# Altium schematic sheet V2_0.SchDoc: gemschematic_Chris_edits
size 409 x 289 mm; Date: 4/8/2022 10:16:15 AM; SheetNumber: 1; Origin: Eagle; GateName_1: G$1; SymbolName_1: A3L-LOC; LibraryName: frames; DeviceSetName: A3L-LOC; Sheet: Sheet:
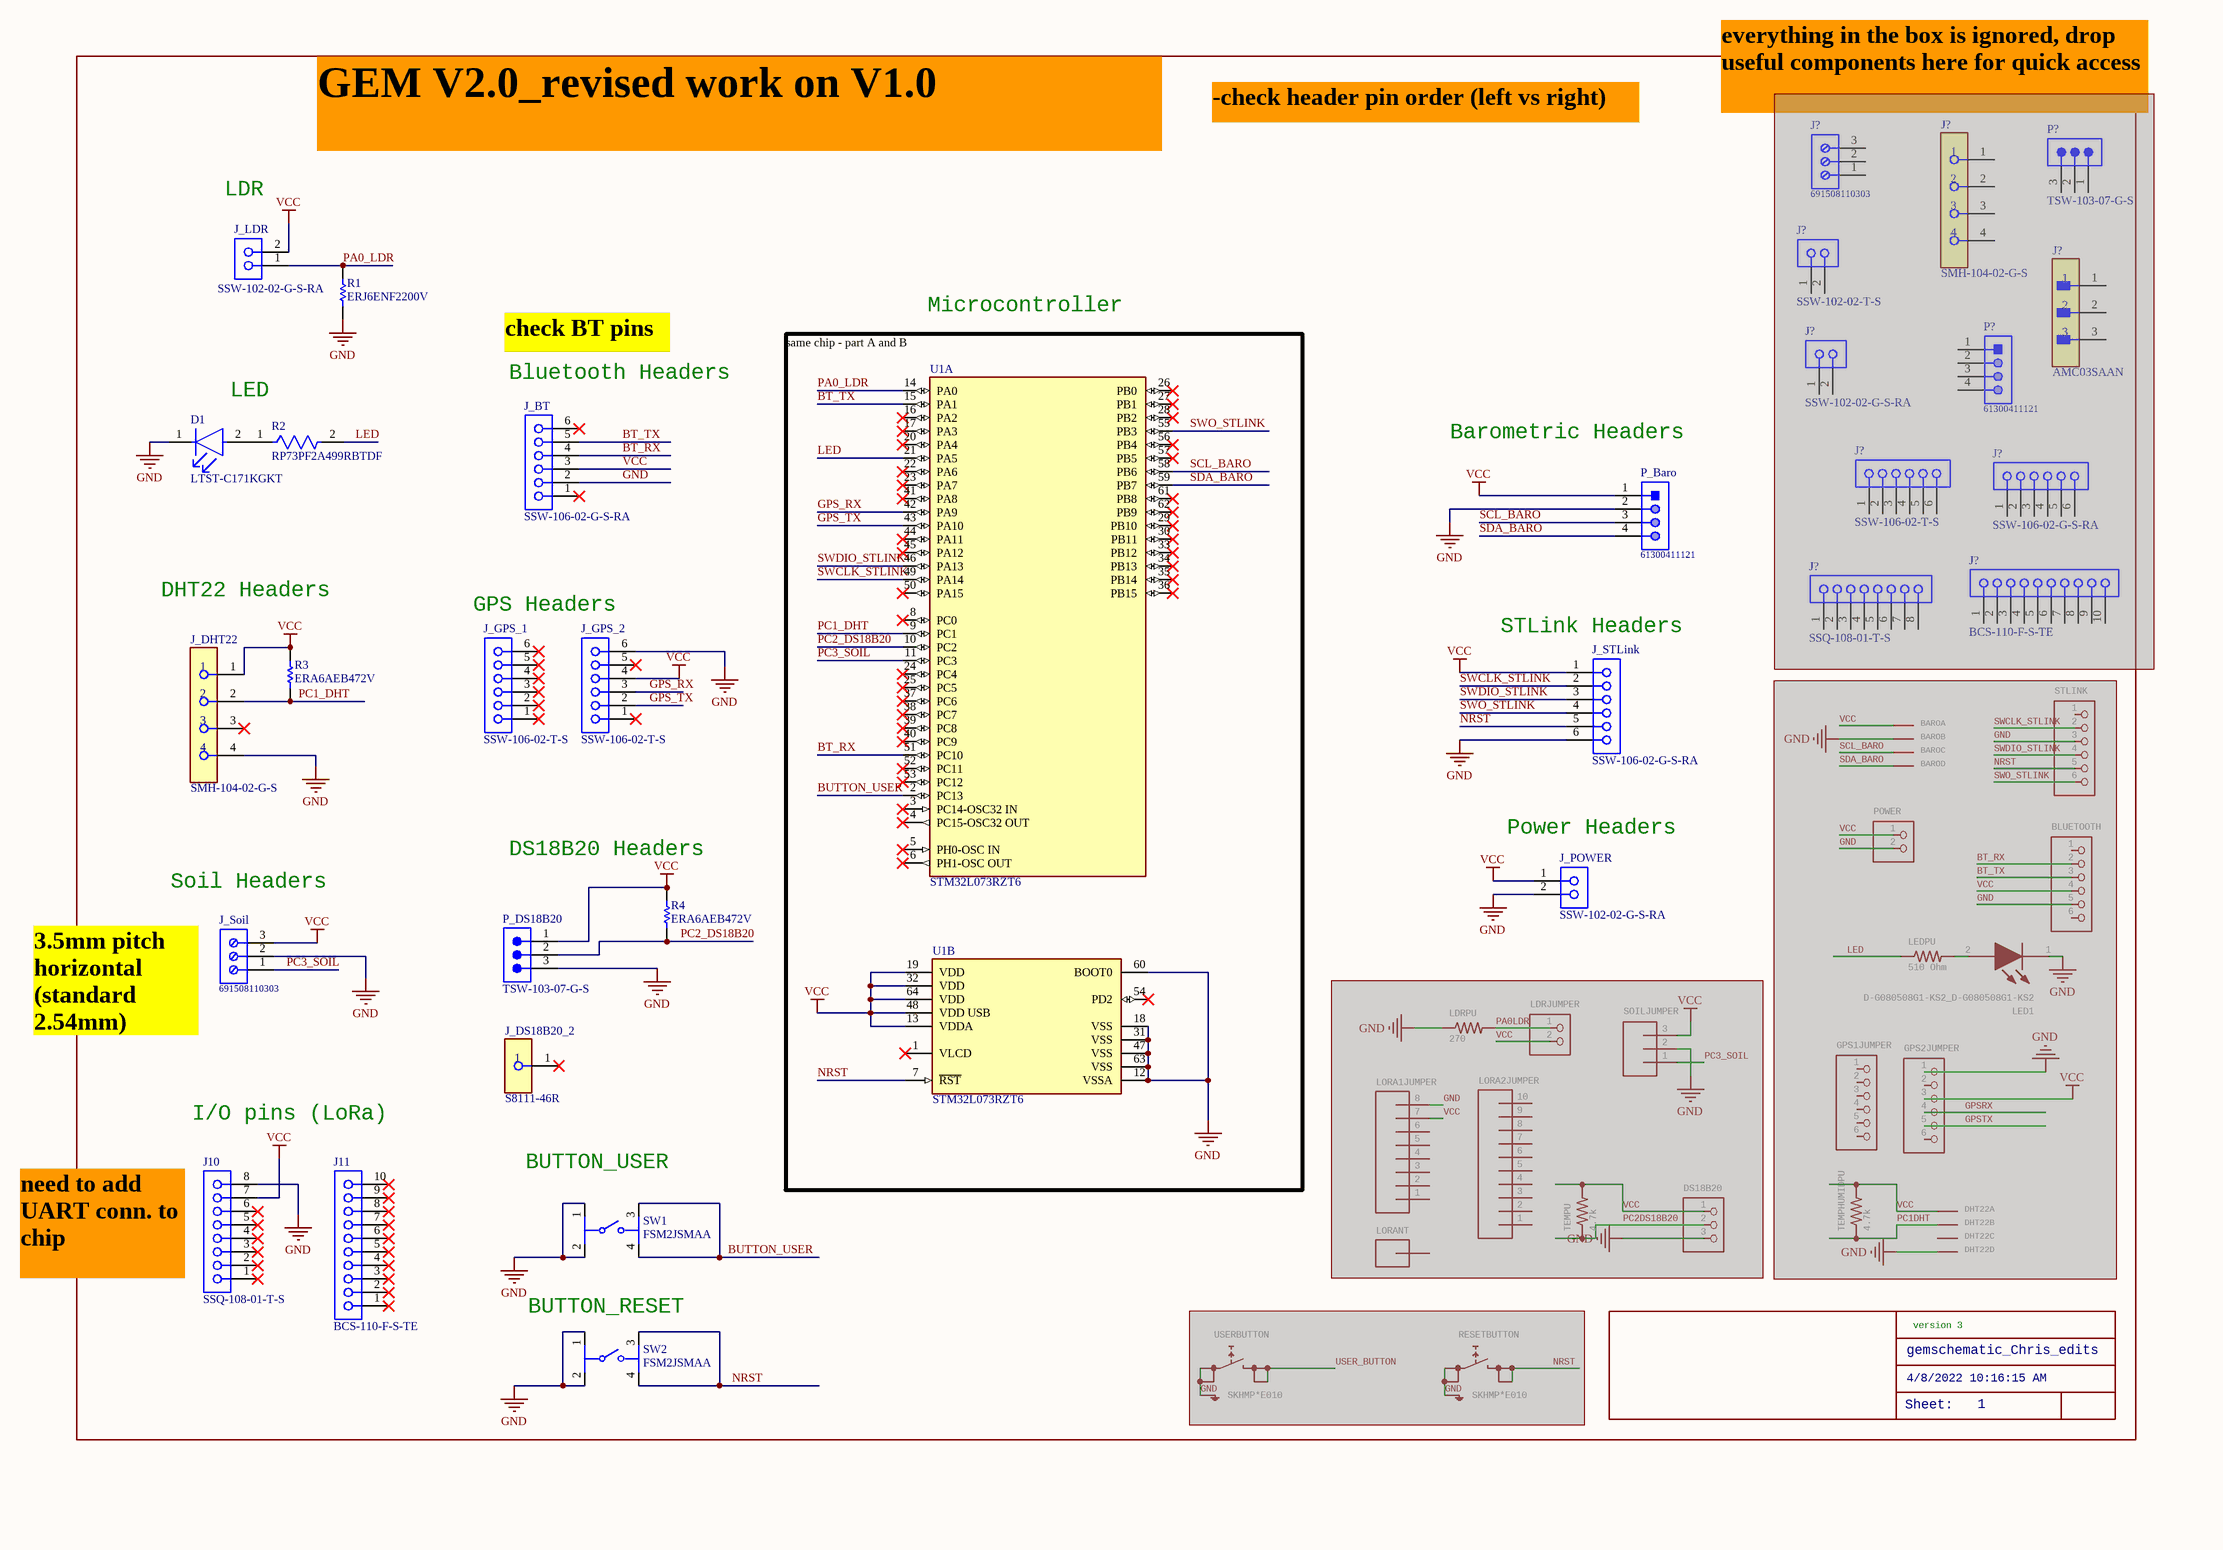
[diagram p0: V2_0.SchDoc]

## Parts
(Parts that share a designator on the sheet are numbered #1, #2 ... from top to bottom, then left to right.)
BARO  22-23-2041  [22-23-2041]  (value not drawn)  (parts A,B,C,D of 4)  (masked out: inside a compile mask, not in the netlist)
BLUETOOTH  PINHD-1X6  [1X06]  (value not drawn)  (masked out: inside a compile mask, not in the netlist)
D1  LTST-C171KGKT  [FP-LTST-C171KGKT-MFG]
DHT22  22-23-2041  [22-23-2041]  (value not drawn)  (parts A,B,C,D of 4)  (masked out: inside a compile mask, not in the netlist)
DS18B20  PINHD-1X3  [1X03]  (value not drawn)  (masked out: inside a compile mask, not in the netlist)
GPS1JUMPER  HEADER-1X670MIL  [1X06_ROUND_70]  (value not drawn)  (masked out: inside a compile mask, not in the netlist)
GPS2JUMPER  HEADER-1X670MIL  [1X06_ROUND_70]  (value not drawn)  (masked out: inside a compile mask, not in the netlist)
J10  SSQ-108-01-T-S  [SMTC-SSQ-108-01-X-S]
J11  BCS-110-F-S-TE  [SMTC-BCS-110-X-S-TE]
J?#1  SMH-104-02-G-S  [FP-SMH-104-02-G-S-MFG]  (masked out: inside a compile mask, not in the netlist)
J?#2  691508110303  [691508110303]  (masked out: inside a compile mask, not in the netlist)
J?#3  SSW-102-02-T-S  [SMTC-SSW-102-02-X-S]  (masked out: inside a compile mask, not in the netlist)
J?#4  AMC03SAAN  [FP-AMC03SAAN-MFG]  (masked out: inside a compile mask, not in the netlist)
J?#5  SSW-102-02-G-S-RA  [SMTC-SSW-102-02-X-S-RA]  (masked out: inside a compile mask, not in the netlist)
J?#6  SSW-106-02-T-S  [SMTC-SSW-106-02-X-S]  (masked out: inside a compile mask, not in the netlist)
J?#7  SSW-106-02-G-S-RA  [SMTC-SSW-106-02-X-S-RA]  (masked out: inside a compile mask, not in the netlist)
J?#8  BCS-110-F-S-TE  [SMTC-BCS-110-X-S-TE]  (masked out: inside a compile mask, not in the netlist)
J?#9  SSQ-108-01-T-S  [SMTC-SSQ-108-01-X-S]  (masked out: inside a compile mask, not in the netlist)
J_BT  SSW-106-02-G-S-RA  [SMTC-SSW-106-02-X-S-RA]
J_DHT22  SMH-104-02-G-S  [FP-SMH-104-02-G-S-MFG]
J_DS18B20_2  S8111-46R  [FP-S8111-46R-MFG]
J_GPS_1  SSW-106-02-T-S  [SMTC-SSW-106-02-X-S]
J_GPS_2  SSW-106-02-T-S  [SMTC-SSW-106-02-X-S]
J_LDR  SSW-102-02-G-S-RA  [SMTC-SSW-102-02-X-S-RA]
J_POWER  SSW-102-02-G-S-RA  [SMTC-SSW-102-02-X-S-RA]
J_Soil  691508110303  [691508110303]
J_STLink  SSW-106-02-G-S-RA  [SMTC-SSW-106-02-X-S-RA]
LDRJUMPER  PINHD-1X2  [1X02]  (value not drawn)  (masked out: inside a compile mask, not in the netlist)
LDRPU  270  [M0805]  (masked out: inside a compile mask, not in the netlist)
LED1  D-G080508G1-KS2_D-G080508G1-KS2  [D-G080508G1-KS2_LEDC2012X85N]  (masked out: inside a compile mask, not in the netlist)
LEDPU  510 Ohm  [M0805]  (masked out: inside a compile mask, not in the netlist)
LORA1JUMPER  CONN_08NO_SILK_FEMALE_PTH  [1X08_NO_SILK]  (value not drawn)  (masked out: inside a compile mask, not in the netlist)
LORA2JUMPER  CONN_10NO_SILK_PTH_FEMALE  [1X10_NO_SILK]  (value not drawn)  (masked out: inside a compile mask, not in the netlist)
LORANT  CONN_01PTH_NO_SILK_YES_STOP  [1X01_NO_SILK]  (value not drawn)  (masked out: inside a compile mask, not in the netlist)
P?#1  TSW-103-07-G-S  [SMTC-TSW-103-07-X-S]  (masked out: inside a compile mask, not in the netlist)
P?#2  61300411121  [61300411121]  (masked out: inside a compile mask, not in the netlist)
P_Baro  61300411121  [61300411121]
P_DS18B20  TSW-103-07-G-S  [SMTC-TSW-103-07-X-S]
POWER  PINHD-1X2  [1X02]  (value not drawn)  (masked out: inside a compile mask, not in the netlist)
R1  ERJ6ENF2200V  [RESC2013X70X40NL20T20]
R2  RP73PF2A499RBTDF  [FP-RP73P-2A-MFG]
R3  ERA6AEB472V  [RESC2013X60X40ML20T25]
R4  ERA6AEB472V  [RESC2013X60X40ML20T25]
RESETBUTTON  SKHMP*E010  [SKHMPXE010]  (masked out: inside a compile mask, not in the netlist)
SOILJUMPER  M03SCREW_LOCK  [SCREWTERMINAL-3.5MM-3_LOCK.007S]  (value not drawn)  (masked out: inside a compile mask, not in the netlist)
STLINK  PINHD-1X6  [1X06]  (value not drawn)  (masked out: inside a compile mask, not in the netlist)
SW1  FSM2JSMAA  [FP-FSM2JSMAA-MFG]
SW2  FSM2JSMAA  [FP-FSM2JSMAA-MFG]
TEMPHUMIDPU  4.7k  [M0805]  (masked out: inside a compile mask, not in the netlist)
TEMPU  4.7k  [M0805]  (masked out: inside a compile mask, not in the netlist)
U1  STM32L073RZT6  [FP-LQFP64-5W-MFG]  (parts A,B of 2)
USERBUTTON  SKHMP*E010  [SKHMPXE010]  (masked out: inside a compile mask, not in the netlist)

## Nets
GND: D1.1(C) J10.8 J_BT.2 J_DHT22.4 J_GPS_2.6 J_POWER.2 J_Soil.2 J_STLink.6 P_Baro.2 P_DS18B20.3 R1.1 SW1.1 SW1.2 SW2.1 SW2.2 U1.12(VSSA) U1.18(VSS) U1.31(VSS) U1.47(VSS) U1.60(BOOT0) U1.63(VSS)
VCC: J10.7 J_BT.3 J_DHT22.1 J_GPS_2.4 J_LDR.2 J_POWER.1 J_Soil.3 J_STLink.1 P_Baro.1 P_DS18B20.1 R3.2 R4.2 U1.13(VDDA) U1.19(VDD) U1.32(VDD) U1.48(VDD_USB) U1.64(VDD)
BT_RX: J_BT.4 U1.51(PC10)
BT_TX: J_BT.5 U1.15(PA1)
BUTTON_USER: SW1.3 SW1.4 U1.2(PC13)
GPS_RX: J_GPS_2.3 U1.42(PA9)
GPS_TX: J_GPS_2.2 U1.43(PA10)
LED: R2.2 U1.21(PA5)
NRST: J_STLink.5 SW2.3 SW2.4 U1.7(~{RST})
PA0_LDR: J_LDR.1 R1.2 U1.14(PA0)
PC1_DHT: J_DHT22.2 R3.1 U1.9(PC1)
PC2_DS18B20: P_DS18B20.2 R4.1 U1.10(PC2)
PC3_SOIL: J_Soil.1 U1.11(PC3)
SCL_BARO: P_Baro.3 U1.58(PB6)
SDA_BARO: P_Baro.4 U1.59(PB7)
SWCLK_STLINK: J_STLink.2 U1.49(PA14)
SWDIO_STLINK: J_STLink.3 U1.46(PA13)
SWO_STLINK: J_STLink.4 U1.55(PB3)
NetD1_2: D1.2(A) R2.1

Not connected (* = marked no-connect by the designer): J10 1* 2* 3* 4* 5* 6*; J11 1* 2* 3* 4* 5* 6* 7* 8* 9* 10*; J_BT 1* 6*; J_DHT22 3*; J_DS18B20_2 1*; J_GPS_1 1* 2* 3* 4* 5* 6*; J_GPS_2 1* 5*; U1 1(VLCD)* 3(PC14-OSC32_IN)* 4(PC15-OSC32_OUT)* 5(PH0-OSC_IN)* 6(PH1-OSC_OUT)* 8(PC0)* 16(PA2)* 17(PA3)* 20(PA4)* 22(PA6)* 23(PA7)* 24(PC4)* 25(PC5)* 26(PB0)* 27(PB1)* 28(PB2)* 29(PB10)* 30(PB11)* 33(PB12)* 34(PB13)* 35(PB14)* 36(PB15)* 37(PC6)* 38(PC7)* 39(PC8)* 40(PC9)* 41(PA8)* 44(PA11)* 45(PA12)* 50(PA15)* 52(PC11)* 53(PC12)* 54(PD2)* 56(PB4)* 57(PB5)* 61(PB8)* 62(PB9)*

## Notes on the sheet
- GEM V2.0_revised work on V1.0
- -check header pin order (left vs right)
- (near J?#2) everything in the box is ignored, drop useful components here for quick access
- (near J_LDR) LDR
- check BT pins
- Microcontroller
- LED
- (near J_BT) Bluetooth Headers
- (near P_Baro) Barometric Headers
- DHT22 Headers
- GPS Headers
- (near J_STLink) STLink Headers
- (near J_Soil) Soil Headers
- (near R4) DS18B20 Headers
- (near J_POWER) Power Headers
- (near J_Soil) 3.5mm pitch horizontal (standard 2.54mm)
- I/O pins (LoRa)
- BUTTON_USER
- (near U1) same chip - part A and B
- (near J10) need to add UART conn. to chip
- (near SW2) BUTTON_RESET
- gemschematic_Chris_edits
- version 3
- Sheet:
- 4/8/2022 10:16:15 AM
- 1

## Library data of the parts
BARO DHT22 = 22-23-2041: .100" (2.54mm) Center Header - 4 Pin; GateName_1: -1; SymbolName_1: MV; GateName_2: -2; SymbolName_2: M; GateName_3: -3; GateName_4: -4; MF: MOLEX; POPULARITY: 21; SymbolName_3: M; SymbolName_4: M; LibraryName: con-molex; DeviceSetName: 22-23-2041; MPN: 22-23-2041; OC_FARNELL: 1462920; OC_NEWARK: 38C0355
BLUETOOTH STLINK = PINHD-1X6: PIN HEADER; GateName_1: A; SymbolName_1: PINHD6; LibraryName: adafruit; DeviceSetName: PINHD-1X6
D1 = CMP-22017-000037-1: LED GREEN CLEAR SMD; Number of LEDs: 1; Viewing Angle: 130°; Lens Style: Rectangular; Dominant Wavelength: 571nm; Test Current: 20mA; Luminous Intensity: 35mcd; Power Rating: 75mW; Forward Voltage: 2.4V; Forward Current: 30mA; Reverse Voltage: 5V; Lens Color: Colorless; Wavelength: 574nm; Height: 0.8mm; Illumination Color: Green; Length: 2mm; Case/Package: 0805; Number of Pins: 2; Number of Elements: 1; Package Quantity: 1; Depth: 1.25mm; Lens Transparency: Clear; Width: 1.25mm; Color: Green; Radiation Hardening: No; Mount: Surface Mount; Packaging: Tape and Reel; Case Code (Metric): 2012; Lead Free: Lead Free; Max Operating Temperature: 85°C; Min Operating Temperature: -55°C; Case Code (Imperial): 0805; Power Dissipation: 75mW
DS18B20 = PINHD-1X3: PIN HEADER; GateName_1: A; SymbolName_1: PINHD3; LibraryName: adafruit; DeviceSetName: PINHD-1X3
GPS1JUMPER GPS2JUMPER = HEADER-1X670MIL: PIN HEADER; GateName_1: A; SymbolName_1: PINHD6; DeviceName: 70MIL; LibraryName: microbuilder; DeviceSetName: HEADER-1X6
J10 J?#9 = CMP-1023-00293-1: SQ Post Socket, Through-hole, Vertical, -55 to 105 degC, 2.54 mm Pitch, 8-Pin, Female, RoHS; Manufacturer: Samtec; Pitch: 2.54 mm; ComponentLink2URL: http://www.samtec.com/documents/webfiles/pdf/SSQ_TH.PDF; RoHS: True; PartNumber: SSQ-108-01-T-S; ComponentLink1Description: Manufacturer URL; PackageDescription: Assembly, Socket Strip .025[0.64] SQ Tail; Mounting Technology: Through-hole; ComponentLink3URL: http://www.samtec.com/documents/webfiles/cpdf/SSQ-1XX-XX-XXX-X-XX-XXX-XX-X-MKT.pdf; Orientation: Vertical; Temperature Range: -55 to 105 degC; ComponentLink1URL: http://www.samtec.com; ComponentLink2Description: Datasheet; PackageVersion: BD, 6/1987; PackageReference: SSQ-108-01-X-S; ComponentLink3Description: Package Specification; DatasheetVersion: F-214
J11 J?#8 = CMP-1023-00017-1: Tiger Claw(TM) Pass-Through Socket, Vertical, -55 to 125 degC, 2.54 mm Pitch, 10-Pin, Female, RoHS; Manufacturer: Samtec; Pitch: 2.54 mm; Orientation: Vertical; Temperature Range: -55 to 125 degC; PackageDescription: Box Connector Socket Strip; DatasheetVersion: F-214; Mounting Technology: Through-hole; RoHS: True; ComponentLink3Description: Package Specification; ComponentLink1Description: Manufacturer URL; ComponentLink3URL: http://www.samtec.com/documents/webfiles/cpdf/BCS-1XX-XXX-X-XX-XXX-MKT.pdf; ComponentLink2Description: Datasheet; ComponentLink1URL: http://www.samtec.com; PackageReference: BCS-110-X-S-TE; ComponentLink2URL: http://www.samtec.com/documents/webfiles/pdf/BCS.PDF; PartNumber: BCS-110-F-S-TE; PackageVersion: BV, 9/1991
J?#1 J_DHT22 = CMP-02766-000076-1: CONN RCPT 4POS 0.1 GOLD SMD R/A; Manufacturer: Samtec; Is Female: yes; Conn Gender: Female; Conn Orientation: Right Angle; Number Of Contacts: 4; Pitch: 2.54mm; Number Of Rows: 1; Device Class L1: Connectors; Device Class L3: unset; Temperature Range High: +125°C; ComponentLink2Description: Datasheet; Package: SMH-104-02-G-S; Digikey Description: CONN RCPT 4POS 0.1 GOLD SMD R/A; Height: 2.54mm; Octopart: https://octopart.com/smh-104-02-g-s-samtec-12561290; Contact Material: Gold,Nickel; Lead Free: Yes; Manufacturer Part Number: SMH-104-02-G-S; Footprint Url: http://suddendocs.samtec.com/prints/smh-1xx-xx-x-x-xx-footprint.pdf; Category: Conn; Device Class L2: Headers and Wire Housings; Temperature: -55°C to +125°C; Automotive: No; Temperature Range Low: -55°C; ComponentLink2URL: http://suddendocs.samtec.com/prints/smh-1xx-xx-xx-x-xx-mkt.pdf; RoHS: TRUE
J?#2 J_Soil = CMP-1502-02491-1: Serie 5081 - 3.50 mm Horizontal Entry SMT with Rising Cage Clamp WR-TBL, 3 pin; Manufacturer: Wurth Elektronik; Pin Number: 3; Pitch: 3.50mm; Package Reference: 691508110303; Mounting Technology: SMT; Operating Temperature: -40to130degC; Publisher: WurthElektronik; Manufacturer URL: http://www.we-online.de; Part Number: 691508110303; Datasheet URL: http://katalog.we-online.de/em/datasheet/6915081103xx.pdf; Packaging: TapeandReelwithCap
J?#3 = CMP-1023-00323-1: SQ Post Socket, Through-hole, Vertical, -55 to 105 degC, 2.54 mm Pitch, 2-Pin, Female, RoHS; Manufacturer: Samtec; Pitch: 2.54 mm; ComponentLink3Description: Package Specification; ComponentLink2Description: Datasheet; ComponentLink1Description: Manufacturer URL; PackageVersion: CA, 6/1987; DatasheetVersion: F-214; PackageDescription: Assembly, Socket Strip .016 X .031 Tail; ComponentLink2URL: http://www.samtec.com/documents/webfiles/pdf/SSW_TH.PDF; RoHS: True; ComponentLink3URL: http://www.samtec.com/documents/webfiles/cpdf/SSW-1XX-XX-XXX-X-XX-XXX-XX-MKT.pdf; ComponentLink1URL: http://www.samtec.com; PackageReference: SSW-102-02-X-S; Mounting Technology: Through-hole; Orientation: Vertical; Temperature Range: -55 to 105 degC; PartNumber: SSW-102-02-T-S
J?#4 = CMP-25680-000024-1: CONN HEADER VERT 3POS 2.54MM; Manufacturer: Sullins; Obsolete Part: true; Current Rating: 3A; Conn Orientation: Straight; Conn Gender: Male; Number Of Contacts: 3; Device Class L2: Headers and Wire Housings; Device Class L3: unset; Number Of Rows: 1; Temperature Range Low: -65°C; Manufacturer Part Number: AMC03SAAN; Height: 8.71mm; Device Class L1: Connectors; ComponentLink2URL: https://media.digikey.com/pdf/Data%20Sheets/Sullins%20PDFs/xxCxxSxxN(-Myyy)_Dwg.pdf; Temperature: -65°C to +200°C; RoHS: TRUE; Temperature Range High: +200°C; Octopart: https://octopart.com/amc03saan-sullins-58186189; Package: AMC03SAAN; Lead Free: Yes; ComponentLink2Description: Datasheet; Digikey Description: CONN HEADER VERT 3POS 2.54MM; Category: Conn; Automotive: No; Pitch: 2.54mm; Contact Material: Gold,Nickel
J?#5 J_LDR J_POWER = CMP-1023-00325-1: SQ Post Socket, Through-hole, Right Angle, -55 to 125 degC, 2.54 mm Pitch, 2-Pin, Female, RoHS; Manufacturer: Samtec; Pitch: 2.54 mm; Orientation: Right Angle; PackageReference: SSW-102-02-X-S-RA; DatasheetVersion: F-214; PackageDescription: Assembly, Socket Strip .016 X .031 Tail; ComponentLink3URL: http://www.samtec.com/documents/webfiles/cpdf/SSW-1XX-XX-XXX-X-XX-XXX-XX-MKT.pdf; Temperature Range: -55 to 125 degC; PartNumber: SSW-102-02-G-S-RA; ComponentLink2Description: Datasheet; PackageVersion: CA, 6/1987; ComponentLink1Description: Manufacturer URL; ComponentLink2URL: http://www.samtec.com/documents/webfiles/pdf/SSW_TH.PDF; Mounting Technology: Through-hole; RoHS: True; ComponentLink1URL: http://www.samtec.com; ComponentLink3Description: Package Specification
J?#6 J_GPS_1 J_GPS_2 = CMP-1023-00360-1: SQ Post Socket, Through-hole, Vertical, -55 to 105 degC, 2.54mm Pitch, 6-Pin, Female, RoHS; Manufacturer: Samtec; ComponentLink1URL: http://www.samtec.com; Temperature Range: -55 to 105 degC; Pitch: 2.54 mm; Mounting Technology: Through-hole; DatasheetVersion: F-214; ComponentLink1Description: Manufacturer URL; PackageVersion: CA, 6/1987; ComponentLink3Description: Package Specification; PackageDescription: Assembly, Socket Strip .016 X .031 Tail; ComponentLink2Description: Datasheet; ComponentLink2URL: http://www.samtec.com/documents/webfiles/pdf/SSW_TH.PDF; PackageReference: SSW-106-02-X-S; ComponentLink3URL: http://www.samtec.com/documents/webfiles/cpdf/SSW-1XX-XX-XXX-X-XX-XXX-XX-MKT.pdf; RoHS: True; PartNumber: SSW-106-02-T-S; Orientation: Vertical
J?#7 J_BT J_STLink = CMP-1023-00363-1: SQ Post Socket, Through-hole, Right Angle, -55 to 125 degC, 2.54mm Pitch, 6-Pin, Female, RoHS; Manufacturer: Samtec; ComponentLink3URL: http://www.samtec.com/documents/webfiles/cpdf/SSW-1XX-XX-XXX-X-XX-XXX-XX-MKT.pdf; PackageVersion: CA, 6/1987; PartNumber: SSW-106-02-G-S-RA; ComponentLink2URL: http://www.samtec.com/documents/webfiles/pdf/SSW_TH.PDF; Mounting Technology: Through-hole; ComponentLink2Description: Datasheet; Pitch: 2.54 mm; RoHS: True; ComponentLink1URL: http://www.samtec.com; Temperature Range: -55 to 125 degC; ComponentLink3Description: Package Specification; DatasheetVersion: F-214; ComponentLink1Description: Manufacturer URL; PackageReference: SSW-106-02-X-S-RA; Orientation: Right Angle; PackageDescription: Assembly, Socket Strip .016 X .031 Tail
J_DS18B20_2 = CMP-15817-000008-1: CBL CLIP C-TYPE SILVER SOLDER; Material Thickness: 0.008inch; Wire/Cable Color: Grey; Mount: Solder; Length: 5mm; Material: Bronze; Height: 0.081inch; Radiation Hardening: No; Packaging: Tape and Reel; Depth: 5mm; Package Quantity: 1500; Orientation: Straight; Color: Silver; REACH SVHC: No SVHC; Width: 5mm
LDRJUMPER POWER = PINHD-1X2: PIN HEADER; GateName_1: G$1; SymbolName_1: PINHD2; POPULARITY: 98; LibraryName: pinhead; DeviceSetName: PINHD-1X2
LDRPU LEDPU TEMPHUMIDPU TEMPU = R-US_M0805: RESISTOR, American symbol; GateName_1: G$1; SymbolName_1: R-US; DeviceSetName: R-US_; DeviceName: M0805; LibraryName: adafruit
LED1 = D-G080508G1-KS2_D-G080508G1-KS2: Light Emitting Diodes (LED) Green 526~531nm 250~330mcd@5mA Top View 0805 RoHS   Source:  Datasheet; MANUFACTURER_NAME: Wuxi ARK Tech Elec; GateName_1: G$1; SymbolName_1: D-G080508G1-KS2_D-G080508G1-KS2; LibraryName: ce-capstone-2022; DeviceSetName: D-G080508G1-KS2_D-G080508G1-KS2; ARROW_PART_NUMBER: ARROW_PART_NUMBER; ARROW_PRICE-STOCK: ARROW_PRICE-STOCK; HEIGHT: 0.85mm; MANUFACTURER_PART_NUMBER: D-G080508G1-KS2; MOUSER_PART_NUMBER: MOUSER_PART_NUMBER; MOUSER_PRICE-STOCK: MOUSER_PRICE-STOCK
LORA1JUMPER = CONN_08NO_SILK_FEMALE_PTH: Multi connection point. Often used as Generic Header-pin footprint for 0.1 inch spaced/style header connections    On any of the 0.1 inch spaced packages, you can populate with these:  Break Away Headers - Straight (PRT-00116)   Break Away Male Headers - Right Angle (PRT-00553)   Female Headers (PRT-00115)   Break Away Headers - Machine Pin (PRT-00117)   Break Away Female Headers - Swiss Machine Pin (PRT-00743)   Arduino Stackable Header - 8 Pin (PRT-09279)        For SCREWTERMINALS and SPRING TERMINALS visit here:  Screw Terimnals on SparkFun.com (5mm/3.5mm/2.54mm spacing)       This device is also useful as a general connection point to wire up your design to another part of your project. Our various solder wires solder well into these plated through hole pads.  Hook-Up Wire - Assortment (Stranded, 22 AWG) (PRT-11375)   Hook-Up Wire - Assortment (Solid Core, 22 AWG) (PRT-11367)   View the entire wire category on our website here          Special notes:     Molex polarized connector foot print use with SKU : PRT-08231 with associated crimp pins and housings. 1MM SMD Version SKU: PRT-10208    NOTES ON THE VARIANTS LOCK and LOCK_LONGPADS... This footprint was designed to help hold the alignment of a through-hole component (i.e.  6-pin header) while soldering it into place. You may notice that each hole has been shifted either up or down by 0.005 of an inch from it's more standard position (which is a perfectly straight line).  This slight alteration caused the pins (the squares in the middle) to touch the edges of the holes.  Because they are alternating, it causes a "brace" to hold the component in place.  0.005 has proven to be the perfect amount of "off-center" position when using our standard breakaway headers. Although looks a little odd when you look at the bare footprint, once you have a header in there, the alteration is very hard to notice.  Also,if you push a header all the way into place, it is covered up entirely on the bottom side.; GateName_1: G$1; PROD_ID: CONN-08438; SymbolName_1: CONN_08; DeviceName: NO_SILK_FEMALE_PTH; LibraryName: SparkFun-Connectors; DeviceSetName: CONN_08
LORA2JUMPER = CONN_10NO_SILK_PTH_FEMALE: Multi connection point. Often used as Generic Header-pin footprint for 0.1 inch spaced/style header connections    On any of the 0.1 inch spaced packages, you can populate with these:  Break Away Headers - Straight (PRT-00116)   Break Away Male Headers - Right Angle (PRT-00553)   Female Headers (PRT-00115)   Break Away Headers - Machine Pin (PRT-00117)   Break Away Female Headers - Swiss Machine Pin (PRT-00743)   Arduino Stackable Header - 10 Pin (PRT-11376)        For SCREWTERMINALS and SPRING TERMINALS visit here:  Screw Terimnals on SparkFun.com (5mm/3.5mm/2.54mm spacing)       This device is also useful as a general connection point to wire up your design to another part of your project. Our various solder wires solder well into these plated through hole pads.  Hook-Up Wire - Assortment (Stranded, 22 AWG) (PRT-11375)   Hook-Up Wire - Assortment (Solid Core, 22 AWG) (PRT-11367)   View the entire wire category on our website here          Special notes:     Molex polarized connector foot print use with SKU : PRT-08231 with associated crimp pins and housings. 1MM SMD Version SKU: PRT-10208    NOTES ON THE VARIANTS LOCK and LOCK_LONGPADS... This footprint was designed to help hold the alignment of a through-hole component (i.e.  6-pin header) while soldering it into place. You may notice that each hole has been shifted either up or down by 0.005 of an inch from it's more standard position (which is a perfectly straight line).  This slight alteration caused the pins (the squares in the middle) to touch the edges of the holes.  Because they are alternating, it causes a "brace" to hold the component in place.  0.005 has proven to be the perfect amount of "off-center" position when using our standard breakaway headers. Although looks a little odd when you look at the bare footprint, once you have a header in there, the alteration is very hard to notice.  Also,if you push a header all the way into place, it is covered up entirely on the bottom side.; GateName_1: G$1; PROD_ID: CONN-11563; SymbolName_1: CONN_10; DeviceName: NO_SILK_PTH_FEMALE; LibraryName: SparkFun-Connectors; DeviceSetName: CONN_10
LORANT = CONN_01PTH_NO_SILK_YES_STOP: Single connection point. Often used as Generic Header-pin footprint for 0.1 inch spaced/style header connections       On any of the 0.1 inch spaced packages, you can populate with these:   Break Away Headers - Straight (PRT-00116)   Break Away Male Headers - Right Angle (PRT-00553)   Female Headers (PRT-00115)   Break Away Headers - Machine Pin (PRT-00117)   Break Away Female Headers - Swiss Machine Pin (PRT-00743)          This device is also useful as a general connection point to wire up your design to another part of your project. Our various solder wires solder well into these plated through hole pads.   Hook-Up Wire - Assortment (Stranded, 22 AWG) (PRT-11375)   Hook-Up Wire - Assortment (Solid Core, 22 AWG) (PRT-11367)   View the entire wire category on our website here          Special notes:    SMTSO-256-ET is a "flush mount" nut for a 4-40 screw. We mostly use this on specialty testbeds; it is a nice way to connect hardware to your PCB at an adjustable hieght.    Also note, the SNAP packages are for using a snappable style connector. We sell a baggie of snaps and they are also used on two LilyPad designs:   Snap Assortment - 30 pack (male and female) (DEV-11347)  LilyPad Arduino SimpleSnap (DEV-10941)   LilyPad SimpleSnap Protoboard (DEV-10940); GateName_1: G$1; SymbolName_1: CONN_01; DeviceName: PTH_NO_SILK_YES_STOP; LibraryName: SparkFun-Connectors; DeviceSetName: CONN_01
P?#1 P_DS18B20 = CMP-1024-00333-1: 0.025" SQ Post Header, Through-hole, Vertical, -55 to 125 degC, 2.54 mm Pitch, 3-Pin, Male, RoHS; Manufacturer: Samtec; Pitch: 2.54 mm; ComponentLink3URL: http://www.samtec.com/documents/webfiles/cpdf/TSW-XXX-XX-XXX-X-XX-XXX-MKT.pdf; Temperature Range: -55 to 125 degC; DatasheetVersion: F-214; ComponentLink1Description: Manufacturer URL; ComponentLink2URL: http://www.samtec.com/documents/webfiles/pdf/TSW_TH.PDF; RoHS: True; Orientation: Vertical; ComponentLink2Description: Datasheet; ComponentLink3Description: Package Specification; PackageDescription: .025[0.64] SQ. Post Terminal Strip Assembly; Mounting Technology: Through-hole; PackageVersion: DM, 8/1988; ComponentLink1URL: http://www.samtec.com; PackageReference: TSW-103-07-X-S; PartNumber: TSW-103-07-G-S
P?#2 P_Baro = CMP-1502-01064-1: THT Vertical Pin Header WR-PHD, Pitch 2.54 mm, Single Row, 4 pins; Manufacturer: Wurth Elektronik; Withstanding Voltage: 500VAC; Rated Current: 3A; Working Voltage: 250VAC; Pin Number: 4; Gender: Male; Contact Resistance: 20mOhm; Pitch: 2.54mm; Manufacturer URL: http://www.we-online.de; Operating Temperature: -40to105degC; Packaging: Bag; Mounting Technology: THT; Package Reference: 61300411121; Datasheet URL: https://katalog.we-online.de/em/datasheet/6130xx11121.pdf; Publisher: WurthElektronik; Part Number: 61300411121; Row Number: Single; Orientation: Vertical
R1 = CMP-2001-00044-1: Manufacturer: Panasonic; Part Number: ERJ6ENF2200V
R2 = CMP-03211-004360-1: RP73P 0805 499Ω 0.25W 25ppm/°C 0.10% 150V; Manufacturer: TE Connectivity; Tolerance: 0.001; Voltage Rating: 150V; Resistance: 499Ω; Power Rating: 0.25W; Octopart: https://octopart.com/rp73pf2a499rbtdf-te+connectivity-45466959; Ipc Land Pattern Name: RESC200125X55; Category: Res; Series: RP73P; ComponentLink2URL: https://www.te.com/commerce/DocumentDelivery/DDEController?Action=srchrtrv&DocNm=1773272&DocType=DS&DocLang=English; ComponentLink2Description: Datasheet; Temperature Range High: +155°C; RoHS: TRUE; Lead Free: Yes; Device Class L1: Passive Components; Package: RP73P-2A; Composition: Thin Film; Device Class L3: Chip SMD Resistors; Device Class L2: Resistors; Height: 0.65mm; Automotive: No; Manufacturer Part Number: RP73PF2A499RBTDF; Temperature Range Low: -55°C; Value: 499Ω; Temperature Coefficient: 25ppm/°C; Temperature: -55°C to +155°C
R3 R4 = CMP-2001-00644-1: Manufacturer: Panasonic; Part Number: ERA6AEB472V
RESETBUTTON USERBUTTON = SKHMP*E010: 6.2 X 6.5mm TACT Switch (SMD)   Source: http://www3.alps.co.jp/WebObjects/catalog.woa/PDF/E/Switch/Tact/SKHM/SKHM.PDF; GateName_1: G$1; SymbolName_1: NORMOPEN_SHIELD; POPULARITY: 5; LibraryName: switch; DeviceSetName: SKHMP*E010
SOILJUMPER = M03SCREW_LOCK: Header 3Standard 3-pin 0.1" header. Use with straight break away headers (SKU : PRT-00116), right angle break away headers (PRT-00553), swiss pins (PRT-00743), machine pins (PRT-00117), and female headers (PRT-00115). Molex polarized connector foot print use with SKU : PRT-08232 with associated crimp pins and housings.; GateName_1: G$1; SymbolName_1: M03; PROD_ID: CONN-08288; DeviceName: SCREW_LOCK; LibraryName: SparkFun-Connectors; DeviceSetName: M03
SW1 SW2 = CMP-03402-000003-1: SWITCH TACTILE SPST-NO 0.05A 24V; Manufacturer: TE Connectivity; Standoff Height: 0.05mm; Contact Current Rating: 50mA; Electromechanical Life: 100000Cycles; Operating Force: 260gf; Contact Resistance: 100mΩ; Package: 0; Temperature Range High: +85°C; Temperature: -35°C to +85°C; Category: Switch; Manufacturer Part Number: FSM2JSMAA; RoHS: TRUE; Mouser Description: Tactile Switches TACTILE 260G FORCE S; Device Class L1: Electromechanical; Mount: Surface Mount; Height: 4.59mm; ComponentLink2URL: https://www.te.com/commerce/DocumentDelivery/DDEController?Action=showdoc&DocId=Customer+Drawing%7F2-1437565-7%7FV%7Fpdf%7FEnglish%7FENG_CD_2-1437565-7_V.pdf%7F2-1437565-8; Temperature Range Low: -35°C; Voltage Rating Dc: 24V; Lead Free: Yes; Automotive: No; Throw Configuration: SPST-NO; Octopart: https://octopart.com/fsm2jsmaa-te+connectivity-41720620; Device Class L2: Switches; Device Class L3: Pushbutton Switches; ComponentLink2Description: Datasheet; Digikey Description: SWITCH TACTILE SPST-NO 0.05A 24V
U1 = CMP-12105-000144-1: IC MCU 32BIT 192KB FLASH 64LQFP; Core Architecture: ARM; Interface: I2C; Oscillator Type: Internal; Min Supply Voltage: 1.65V; Frequency: 32MHz; Number of I/Os: 51; RAM Size: 20KB; Peripherals: Brown-out Detect/Reset; Max Supply Voltage: 3.6V; Max Operating Temperature: 85°C; Case/Package: LQFP; RoHS Compliant: Yes; Number of Pins: 64; Min Operating Temperature: -40°C; Memory Type: FLASH; Packaging: Tray; Memory Size: 192KB; REACH SVHC: No SVHC